# EAGLE design violed_v2_5 (EAGLE 8.2.1)
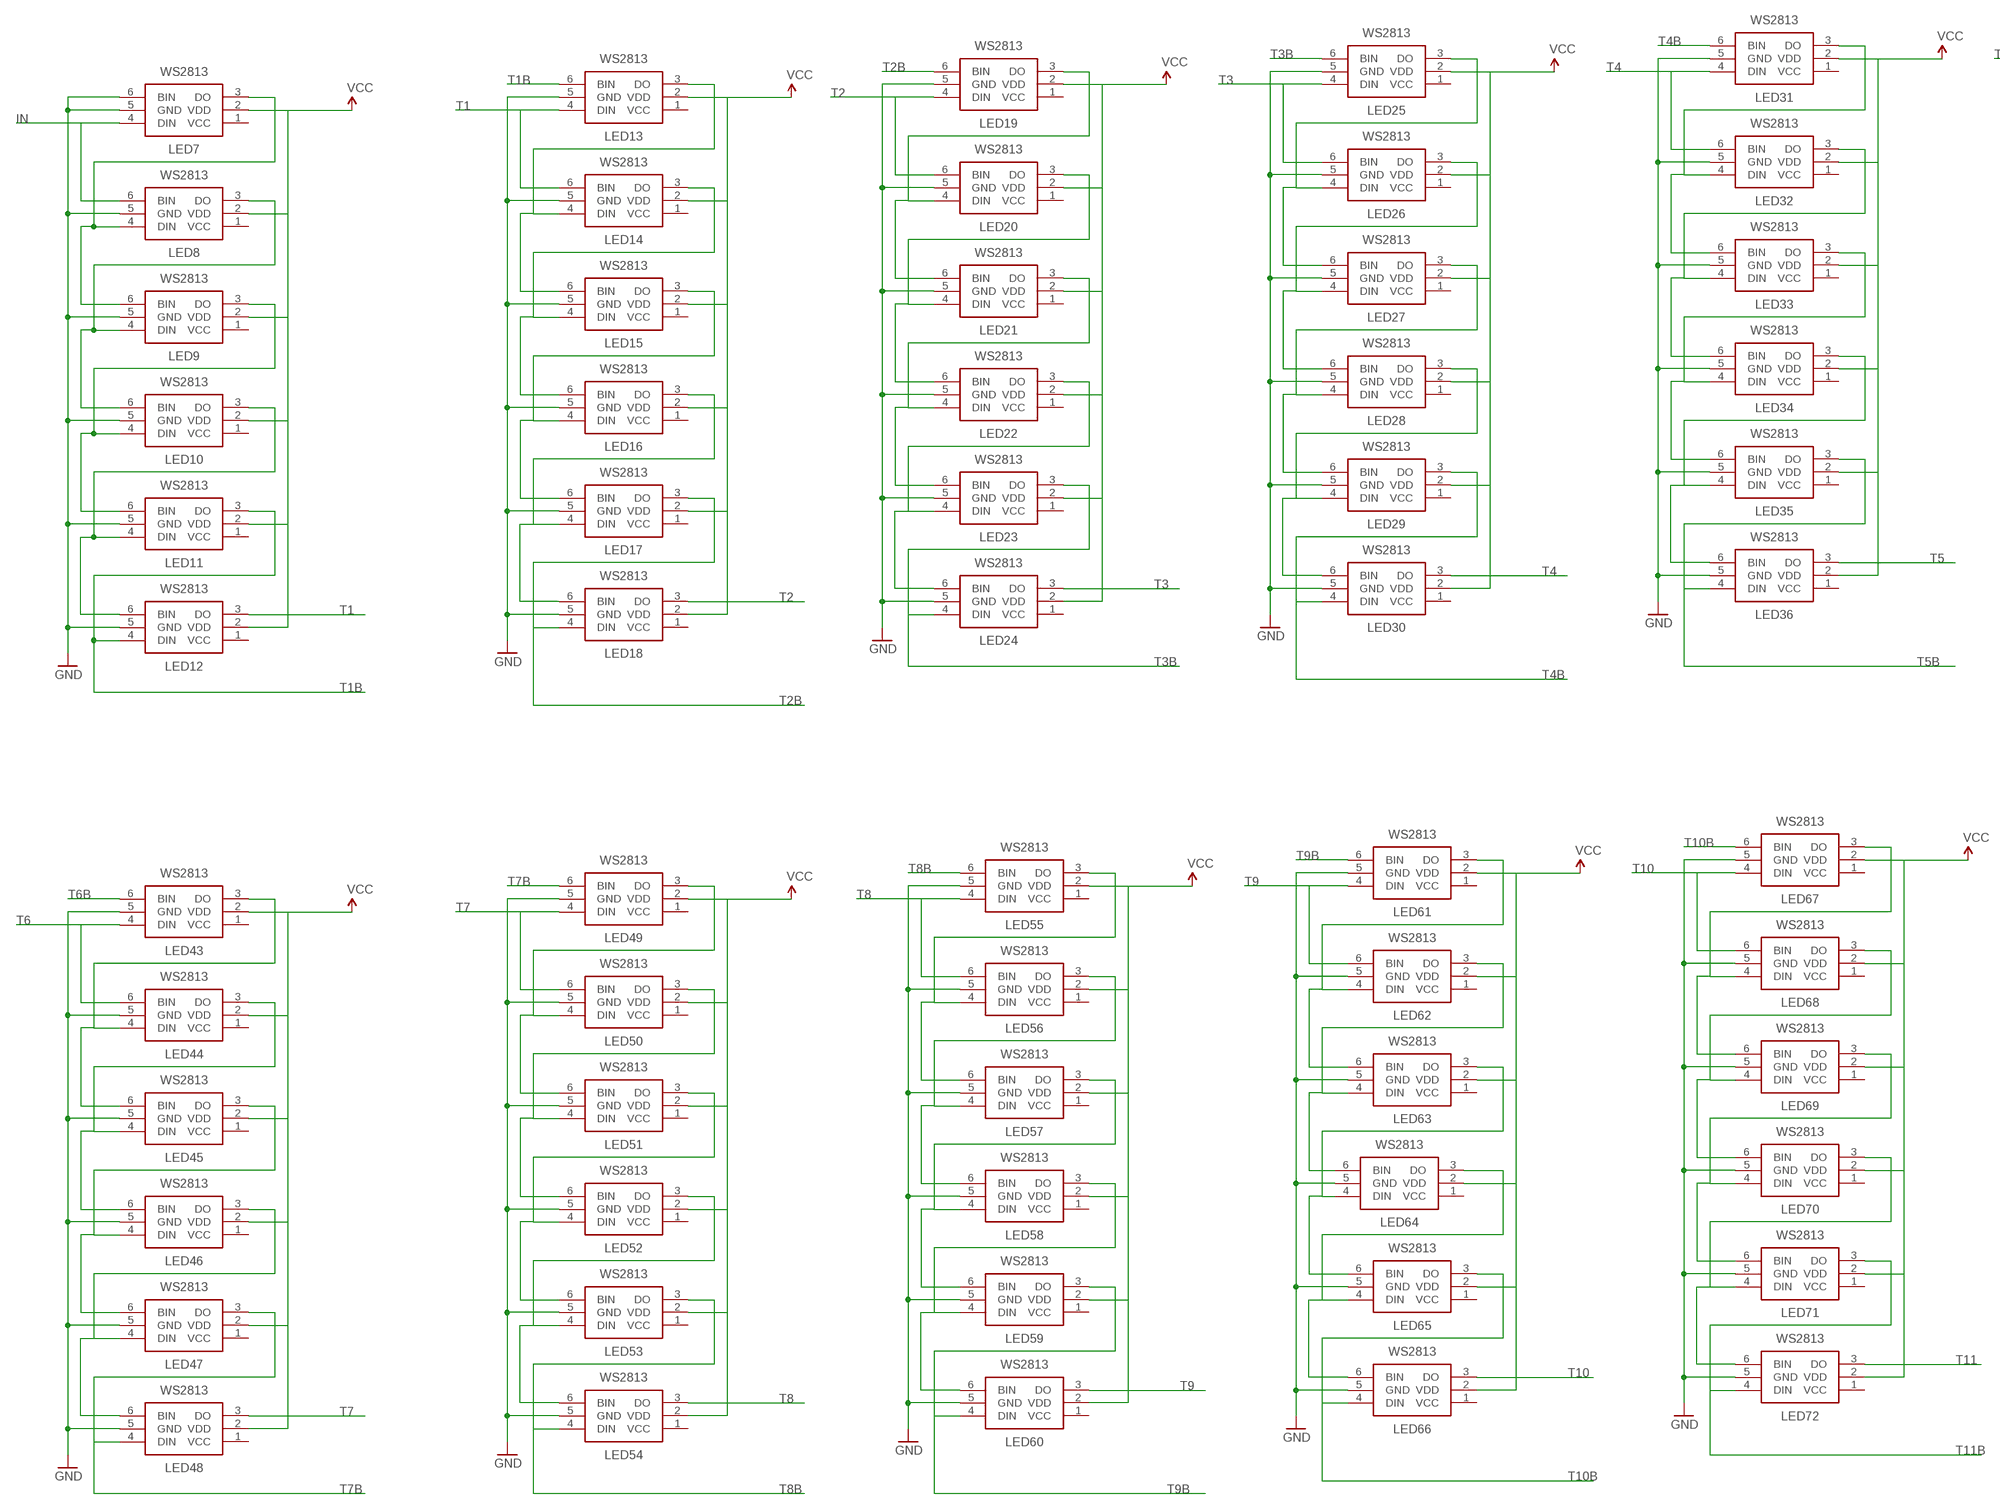
[diagram p0: schematic, sheet 1, part 1 of 2]
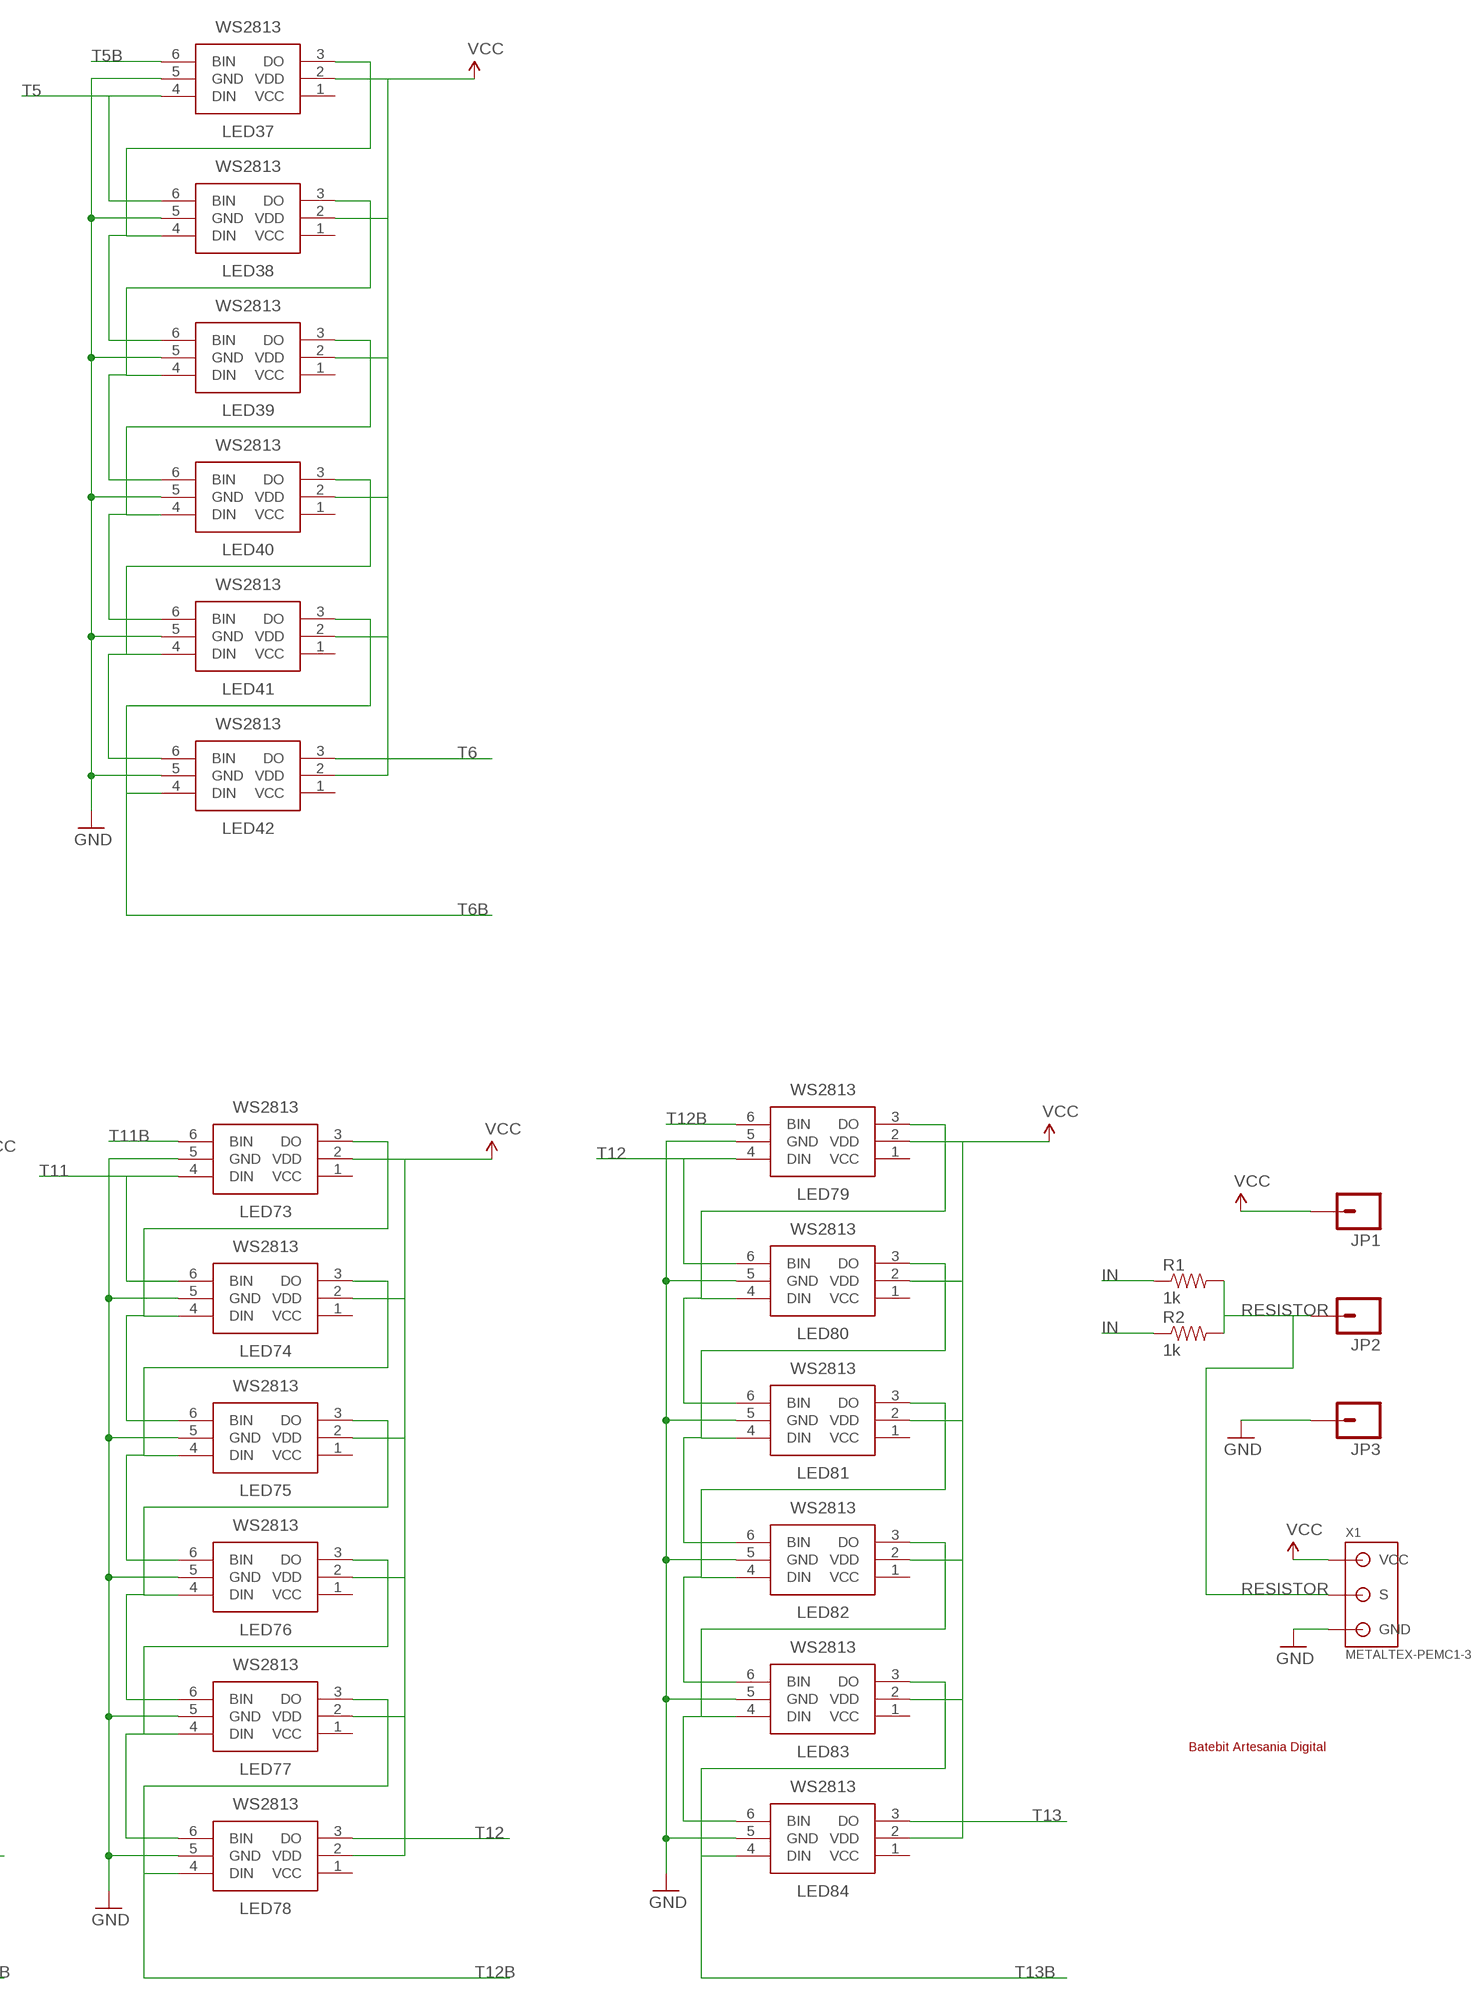
[diagram p1: schematic, sheet 1, part 2 of 2]

## Parts
JP1  M01PTH_LONGPAD  [1X01_LONGPAD]
JP2  M01PTH_LONGPAD  [1X01_LONGPAD]
JP3  M01PTH_LONGPAD  [1X01_LONGPAD]
LED7  WS2813  [WS2812]
LED8  WS2813  [WS2812]
LED9  WS2813  [WS2812]
LED10  WS2813  [WS2812]
LED11  WS2813  [WS2812]
LED12  WS2813  [WS2812]
LED13  WS2813  [WS2812]
LED14  WS2813  [WS2812]
LED15  WS2813  [WS2812]
LED16  WS2813  [WS2812]
LED17  WS2813  [WS2812]
LED18  WS2813  [WS2812]
LED19  WS2813  [WS2812]
LED20  WS2813  [WS2812]
LED21  WS2813  [WS2812]
LED22  WS2813  [WS2812]
LED23  WS2813  [WS2812]
LED24  WS2813  [WS2812]
LED25  WS2813  [WS2812]
LED26  WS2813  [WS2812]
LED27  WS2813  [WS2812]
LED28  WS2813  [WS2812]
LED29  WS2813  [WS2812]
LED30  WS2813  [WS2812]
LED31  WS2813  [WS2812]
LED32  WS2813  [WS2812]
LED33  WS2813  [WS2812]
LED34  WS2813  [WS2812]
LED35  WS2813  [WS2812]
LED36  WS2813  [WS2812]
LED37  WS2813  [WS2812]
LED38  WS2813  [WS2812]
LED39  WS2813  [WS2812]
LED40  WS2813  [WS2812]
LED41  WS2813  [WS2812]
LED42  WS2813  [WS2812]
LED43  WS2813  [WS2812]
LED44  WS2813  [WS2812]
LED45  WS2813  [WS2812]
LED46  WS2813  [WS2812]
LED47  WS2813  [WS2812]
LED48  WS2813  [WS2812]
LED49  WS2813  [WS2812]
LED50  WS2813  [WS2812]
LED51  WS2813  [WS2812]
LED52  WS2813  [WS2812]
LED53  WS2813  [WS2812]
LED54  WS2813  [WS2812]
LED55  WS2813  [WS2812]
LED56  WS2813  [WS2812]
LED57  WS2813  [WS2812]
LED58  WS2813  [WS2812]
LED59  WS2813  [WS2812]
LED60  WS2813  [WS2812]
LED61  WS2813  [WS2812]
LED62  WS2813  [WS2812]
LED63  WS2813  [WS2812]
LED64  WS2813  [WS2812]
LED65  WS2813  [WS2812]
LED66  WS2813  [WS2812]
LED67  WS2813  [WS2812]
LED68  WS2813  [WS2812]
LED69  WS2813  [WS2812]
LED70  WS2813  [WS2812]
LED71  WS2813  [WS2812]
LED72  WS2813  [WS2812]
LED73  WS2813  [WS2812]
LED74  WS2813  [WS2812]
LED75  WS2813  [WS2812]
LED76  WS2813  [WS2812]
LED77  WS2813  [WS2812]
LED78  WS2813  [WS2812]
LED79  WS2813  [WS2812]
LED80  WS2813  [WS2812]
LED81  WS2813  [WS2812]
LED82  WS2813  [WS2812]
LED83  WS2813  [WS2812]
LED84  WS2813  [WS2812]
R1  1k  RESISTOR0805-RES  [0805]
R2  1k  RESISTORPTH-1/4W  [AXIAL-0.4]
U$1  BATEBITTOP  [BATEBIT_MED_TOP_LAYER]
X1  METALTEX-PEMC1-3  [METALTEX-PEMC1-3-PACKAGE-LONG-PAD]

## Nets
GND: JP3.1 LED7.5(GND) LED7.6(BIN) LED8.5(GND) LED9.5(GND) LED10.5(GND) LED11.5(GND) LED12.5(GND) LED13.5(GND) LED14.5(GND) LED15.5(GND) LED16.5(GND) LED17.5(GND) LED18.5(GND) LED19.5(GND) LED20.5(GND) LED21.5(GND) LED22.5(GND) LED23.5(GND) LED24.5(GND) LED25.5(GND) LED26.5(GND) LED27.5(GND) LED28.5(GND) LED29.5(GND) LED30.5(GND) LED31.5(GND) LED32.5(GND) LED33.5(GND) LED34.5(GND) LED35.5(GND) LED36.5(GND) LED37.5(GND) LED38.5(GND) LED39.5(GND) LED40.5(GND) LED41.5(GND) LED42.5(GND) LED43.5(GND) LED44.5(GND) LED45.5(GND) LED46.5(GND) LED47.5(GND) LED48.5(GND) LED49.5(GND) LED50.5(GND) LED51.5(GND) LED52.5(GND) LED53.5(GND) LED54.5(GND) LED55.5(GND) LED56.5(GND) LED57.5(GND) LED58.5(GND) LED59.5(GND) LED60.5(GND) LED61.5(GND) LED62.5(GND) LED63.5(GND) LED64.5(GND) LED65.5(GND) LED66.5(GND) LED67.5(GND) LED68.5(GND) LED69.5(GND) LED70.5(GND) LED71.5(GND) LED72.5(GND) LED73.5(GND) LED74.5(GND) LED75.5(GND) LED76.5(GND) LED77.5(GND) LED78.5(GND) LED79.5(GND) LED80.5(GND) LED81.5(GND) LED82.5(GND) LED83.5(GND) LED84.5(GND) X1.1(GND)
IN: LED7.4(DIN) LED8.6(BIN) R1.1 R2.P$1
N$6: LED7.3(DO) LED8.4(DIN) LED9.6(BIN)
N$7: LED8.3(DO) LED9.4(DIN) LED10.6(BIN)
N$8: LED9.3(DO) LED10.4(DIN) LED11.6(BIN)
N$9: LED10.3(DO) LED11.4(DIN) LED12.6(BIN)
N$11: LED13.3(DO) LED14.4(DIN) LED15.6(BIN)
N$12: LED14.3(DO) LED15.4(DIN) LED16.6(BIN)
N$13: LED15.3(DO) LED16.4(DIN) LED17.6(BIN)
N$14: LED16.3(DO) LED17.4(DIN) LED18.6(BIN)
N$16: LED19.3(DO) LED20.4(DIN) LED21.6(BIN)
N$17: LED20.3(DO) LED21.4(DIN) LED22.6(BIN)
N$18: LED21.3(DO) LED22.4(DIN) LED23.6(BIN)
N$19: LED22.3(DO) LED23.4(DIN) LED24.6(BIN)
N$21: LED25.3(DO) LED26.4(DIN) LED27.6(BIN)
N$22: LED26.3(DO) LED27.4(DIN) LED28.6(BIN)
N$23: LED27.3(DO) LED28.4(DIN) LED29.6(BIN)
N$24: LED28.3(DO) LED29.4(DIN) LED30.6(BIN)
N$26: LED31.3(DO) LED32.4(DIN) LED33.6(BIN)
N$27: LED32.3(DO) LED33.4(DIN) LED34.6(BIN)
N$28: LED33.3(DO) LED34.4(DIN) LED35.6(BIN)
N$29: LED34.3(DO) LED35.4(DIN) LED36.6(BIN)
N$31: LED37.3(DO) LED38.4(DIN) LED39.6(BIN)
N$32: LED38.3(DO) LED39.4(DIN) LED40.6(BIN)
N$33: LED39.3(DO) LED40.4(DIN) LED41.6(BIN)
N$34: LED40.3(DO) LED41.4(DIN) LED42.6(BIN)
N$36: LED43.3(DO) LED44.4(DIN) LED45.6(BIN)
N$37: LED44.3(DO) LED45.4(DIN) LED46.6(BIN)
N$38: LED45.3(DO) LED46.4(DIN) LED47.6(BIN)
N$39: LED46.3(DO) LED47.4(DIN) LED48.6(BIN)
N$41: LED49.3(DO) LED50.4(DIN) LED51.6(BIN)
N$42: LED50.3(DO) LED51.4(DIN) LED52.6(BIN)
N$43: LED51.3(DO) LED52.4(DIN) LED53.6(BIN)
N$44: LED52.3(DO) LED53.4(DIN) LED54.6(BIN)
N$46: LED55.3(DO) LED56.4(DIN) LED57.6(BIN)
N$47: LED56.3(DO) LED57.4(DIN) LED58.6(BIN)
N$48: LED57.3(DO) LED58.4(DIN) LED59.6(BIN)
N$49: LED58.3(DO) LED59.4(DIN) LED60.6(BIN)
N$51: LED61.3(DO) LED62.4(DIN) LED63.6(BIN)
N$52: LED62.3(DO) LED63.4(DIN) LED64.6(BIN)
N$53: LED63.3(DO) LED64.4(DIN) LED65.6(BIN)
N$54: LED64.3(DO) LED65.4(DIN) LED66.6(BIN)
N$56: LED67.3(DO) LED68.4(DIN) LED69.6(BIN)
N$57: LED68.3(DO) LED69.4(DIN) LED70.6(BIN)
N$58: LED69.3(DO) LED70.4(DIN) LED71.6(BIN)
N$59: LED70.3(DO) LED71.4(DIN) LED72.6(BIN)
N$61: LED73.3(DO) LED74.4(DIN) LED75.6(BIN)
N$62: LED74.3(DO) LED75.4(DIN) LED76.6(BIN)
N$63: LED75.3(DO) LED76.4(DIN) LED77.6(BIN)
N$64: LED76.3(DO) LED77.4(DIN) LED78.6(BIN)
N$66: LED79.3(DO) LED80.4(DIN) LED81.6(BIN)
N$67: LED80.3(DO) LED81.4(DIN) LED82.6(BIN)
N$68: LED81.3(DO) LED82.4(DIN) LED83.6(BIN)
N$69: LED82.3(DO) LED83.4(DIN) LED84.6(BIN)
RESISTOR: JP2.1 R1.2 R2.P$2 X1.2(S)
T1: LED12.3(DO) LED13.4(DIN) LED14.6(BIN)
T1B: LED11.3(DO) LED12.4(DIN) LED13.6(BIN)
T2: LED18.3(DO) LED19.4(DIN) LED20.6(BIN)
T2B: LED17.3(DO) LED18.4(DIN) LED19.6(BIN)
T3: LED24.3(DO) LED25.4(DIN) LED26.6(BIN)
T3B: LED23.3(DO) LED24.4(DIN) LED25.6(BIN)
T4: LED30.3(DO) LED31.4(DIN) LED32.6(BIN)
T4B: LED29.3(DO) LED30.4(DIN) LED31.6(BIN)
T5: LED36.3(DO) LED37.4(DIN) LED38.6(BIN)
T5B: LED35.3(DO) LED36.4(DIN) LED37.6(BIN)
T6: LED42.3(DO) LED43.4(DIN) LED44.6(BIN)
T6B: LED41.3(DO) LED42.4(DIN) LED43.6(BIN)
T7: LED48.3(DO) LED49.4(DIN) LED50.6(BIN)
T7B: LED47.3(DO) LED48.4(DIN) LED49.6(BIN)
T8: LED54.3(DO) LED55.4(DIN) LED56.6(BIN)
T8B: LED53.3(DO) LED54.4(DIN) LED55.6(BIN)
T9: LED60.3(DO) LED61.4(DIN) LED62.6(BIN)
T9B: LED59.3(DO) LED60.4(DIN) LED61.6(BIN)
T10: LED66.3(DO) LED67.4(DIN) LED68.6(BIN)
T10B: LED65.3(DO) LED66.4(DIN) LED67.6(BIN)
T11: LED72.3(DO) LED73.4(DIN) LED74.6(BIN)
T11B: LED71.3(DO) LED72.4(DIN) LED73.6(BIN)
T12: LED78.3(DO) LED79.4(DIN) LED80.6(BIN)
T12B: LED77.3(DO) LED78.4(DIN) LED79.6(BIN)
T13: LED84.3(DO)
T13B: LED83.3(DO) LED84.4(DIN)
VCC: JP1.1 LED7.2(VDD) LED8.2(VDD) LED9.2(VDD) LED10.2(VDD) LED11.2(VDD) LED12.2(VDD) LED13.2(VDD) LED14.2(VDD) LED15.2(VDD) LED16.2(VDD) LED17.2(VDD) LED18.2(VDD) LED19.2(VDD) LED20.2(VDD) LED21.2(VDD) LED22.2(VDD) LED23.2(VDD) LED24.2(VDD) LED25.2(VDD) LED26.2(VDD) LED27.2(VDD) LED28.2(VDD) LED29.2(VDD) LED30.2(VDD) LED31.2(VDD) LED32.2(VDD) LED33.2(VDD) LED34.2(VDD) LED35.2(VDD) LED36.2(VDD) LED37.2(VDD) LED38.2(VDD) LED39.2(VDD) LED40.2(VDD) LED41.2(VDD) LED42.2(VDD) LED43.2(VDD) LED44.2(VDD) LED45.2(VDD) LED46.2(VDD) LED47.2(VDD) LED48.2(VDD) LED49.2(VDD) LED50.2(VDD) LED51.2(VDD) LED52.2(VDD) LED53.2(VDD) LED54.2(VDD) LED55.2(VDD) LED56.2(VDD) LED57.2(VDD) LED58.2(VDD) LED59.2(VDD) LED60.2(VDD) LED61.2(VDD) LED62.2(VDD) LED63.2(VDD) LED64.2(VDD) LED65.2(VDD) LED66.2(VDD) LED67.2(VDD) LED68.2(VDD) LED69.2(VDD) LED70.2(VDD) LED71.2(VDD) LED72.2(VDD) LED73.2(VDD) LED74.2(VDD) LED75.2(VDD) LED76.2(VDD) LED77.2(VDD) LED78.2(VDD) LED79.2(VDD) LED80.2(VDD) LED81.2(VDD) LED82.2(VDD) LED83.2(VDD) LED84.2(VDD) X1.3(VCC)
Unconnected: LED7.1(VCC) LED8.1(VCC) LED9.1(VCC) LED10.1(VCC) LED11.1(VCC) LED12.1(VCC) LED13.1(VCC) LED14.1(VCC) LED15.1(VCC) LED16.1(VCC) LED17.1(VCC) LED18.1(VCC) LED19.1(VCC) LED20.1(VCC) LED21.1(VCC) LED22.1(VCC) LED23.1(VCC) LED24.1(VCC) LED25.1(VCC) LED26.1(VCC) LED27.1(VCC) LED28.1(VCC) LED29.1(VCC) LED30.1(VCC) LED31.1(VCC) LED32.1(VCC) LED33.1(VCC) LED34.1(VCC) LED35.1(VCC) LED36.1(VCC) LED37.1(VCC) LED38.1(VCC) LED39.1(VCC) LED40.1(VCC) LED41.1(VCC) LED42.1(VCC) LED43.1(VCC) LED44.1(VCC) LED45.1(VCC) LED46.1(VCC) LED47.1(VCC) LED48.1(VCC) LED49.1(VCC) LED50.1(VCC) LED51.1(VCC) LED52.1(VCC) LED53.1(VCC) LED54.1(VCC) LED55.1(VCC) LED56.1(VCC) LED57.1(VCC) LED58.1(VCC) LED59.1(VCC) LED60.1(VCC) LED61.1(VCC) LED62.1(VCC) LED63.1(VCC) LED64.1(VCC) LED65.1(VCC) LED66.1(VCC) LED67.1(VCC) LED68.1(VCC) LED69.1(VCC) LED70.1(VCC) LED71.1(VCC) LED72.1(VCC) LED73.1(VCC) LED74.1(VCC) LED75.1(VCC) LED76.1(VCC) LED77.1(VCC) LED78.1(VCC) LED79.1(VCC) LED80.1(VCC) LED81.1(VCC) LED82.1(VCC) LED83.1(VCC) LED84.1(VCC)

## Library data of the parts
JP1-JP3 = Batebit:M01: Header 1 Standard 1-pin 0.1" header. Use with straight break away headers (SKU : PRT-00116), right angle break away headers (PRT-00553), swiss pins (PRT-00743), machine pins (PRT-00117), and female headers (PRT-00115).
LED7-LED84 = Batebit:WS2813: Intelligent control integrated LED light source Source: Datasheet <http://www.tme.eu/gb/Document/cf443473af21167b0bdd177fb1a7e90a/WS2813.pdf>; DESCRIPTION: Intelligent control integrated LED light source; HEIGHT: mm; MANUFACTURER_NAME: Worldsemi; MANUFACTURER_PART_NUMBER: WS2813; SUPPLIER_NAME: RS
R1 R2 = Batebit:RESISTOR: Resistor Basic schematic elements and footprints for 0603, 1206, and PTH resistors.
U$1 = Batebit:BATEBIT
X1 = Batebit:METALTEX-PEMC1-3: Metaltex PEMC1-2 (2.54 mm) 3 pin Wire to board connector. Pitch: 2,54 mm, (0.100") Number of pins: 3 Created by Batebit

## Net classes
0 default: width 0.61 mm, drill 1 mm, clearance 0.61 mm

## Board
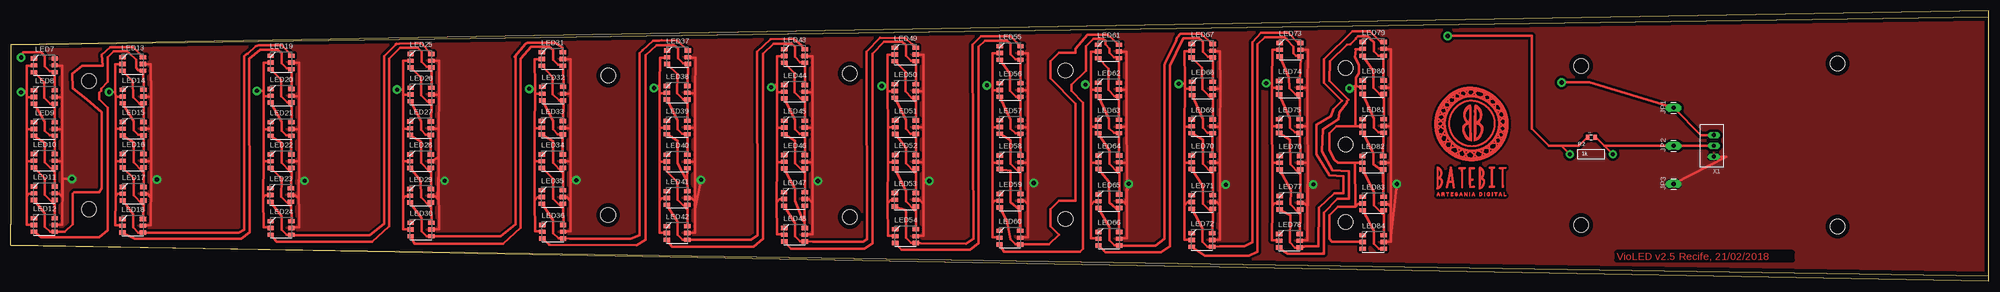
[diagram p2: board, top side]
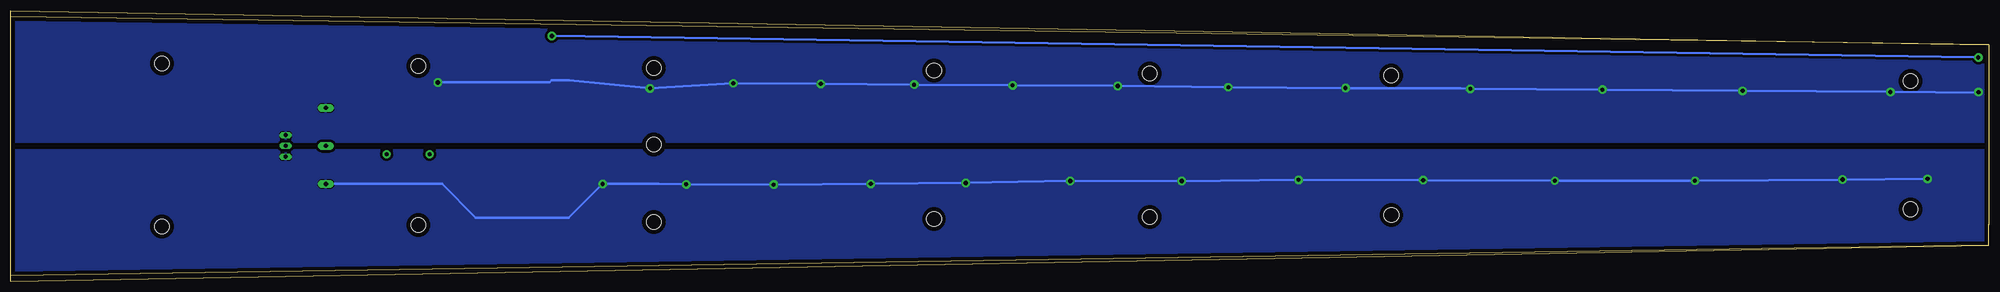
[diagram p3: board, bottom side, seen from below]

Size 468.09 x 64 mm. Coordinates in mm from the lower left corner, seen from the top.
Outline: 0.01,13.41 0.01,8.46 468,0 468,64 0.01,55.86
Outline: 0.01,55.86 0.01,35.91
Outline: 0.01,35.89 0.01,13.41
Outline: 0.01,13.41 0.01,13.39
Outline: 0.01,55.86 468.09,62.59
Outline: 0,8.46 468.01,1.32
Copper layers (1*16): Top 0.035mm / dielectric 1.5mm / Bottom 0.035mm
Design rules "default": minimum track width 6mil, minimum drill 0.35mm, track to track 6mil, track to pad 6mil, pad to pad 6mil, via to via 6mil, smd to smd 6mil, copper to edge 40mil, drill to drill 6mil, minimum pad ring 10mil, minimum via ring 8mil, stop-mask expansion 4mil, vias tented up to drill 0mil, thermal gap 10mil
Holes 3.5 mm at 18.56,47.35 18.56,17 141.42,48.6 141.37,15.65 198.61,49.15 198.61,15.15 249.6,49.8 249.6,14.7 315.85,50.4 315.85,14 371.56,50.85 371.56,13.25 432.31,51.45 432.31,12.9 315.85,32.3

### Footprints (pad centres in the part's own frame; a part is rotated, then mirrored left to right if it is on the bottom)
1X01_LONGPAD = drill 1 pad 1.88 long: 1 0,0
WS2812 = smd 1.5 x 1: 1 2.45,-1.6; 2 2.45,0; 3 2.45,1.6; 4 -2.45,1.6; 5 -2.45,0; 6 -2.45,-1.6
0805 = smd 0.8 x 1.2: 1 -0.9,0; 2 0.9,0
AXIAL-0.4 = drill 1 pad 1.88: P$1 -5.08,0; P$2 5.08,0
METALTEX-PEMC1-3-PACKAGE-LONG-PAD = drill 1.016 long: 1 -2.54,-0.5; 2 0,-0.5; 3 2.54,-0.5

### Placement (x,y rotation side)
JP1  393.5,41 90 top
JP2  393.5,32 90 top
JP3  393.5,23 90 top
LED7  8,51.04 180 top
LED8  8,43.55 180 top
LED9  8,35.96 180 top
LED10  8,28.47 180 top
LED11  8,20.78 180 top
LED12  8,13.29 180 top
LED13  28.9,51.34 180 top
LED14  29,43.65 180 top
LED15  29,36.06 180 top
LED16  29,28.47 180 top
LED17  29,20.68 180 top
LED18  28.9,13.09 180 top
LED19  64,51.74 180 top
LED20  64,43.85 180 top
LED21  64,35.96 180 top
LED22  64,28.37 180 top
LED23  63.9,20.38 180 top
LED24  64,12.59 180 top
LED25  97.1,52.14 180 top
LED26  97.1,44.15 180 top
LED27  97,36.16 180 top
LED28  97,28.37 180 top
LED29  97,20.18 180 top
LED30  97.1,12.19 180 top
LED31  128.2,52.54 180 top
LED32  128.3,44.35 180 top
LED33  128.2,36.26 180 top
LED34  128.2,28.37 180 top
LED35  128.2,19.88 180 top
LED36  128.3,11.69 180 top
LED37  157.8,52.94 180 top
LED38  157.7,44.55 180 top
LED39  157.7,36.36 180 top
LED40  157.7,28.27 180 top
LED41  157.7,19.68 180 top
LED42  157.7,11.39 180 top
LED43  185.5,53.24 180 top
LED44  185.5,44.8 180 top
LED45  185.5,36.36 180 top
LED46  185.5,28.22 180 top
LED47  185.45,19.43 180 top
LED48  185.5,10.99 180 top
LED49  211.7,53.59 180 top
LED50  211.7,45 180 top
LED51  211.75,36.41 180 top
LED52  211.75,28.22 180 top
LED53  211.7,19.23 180 top
LED54  211.75,10.64 180 top
LED55  236.5,53.94 180 top
LED56  236.5,45.2 180 top
LED57  236.5,36.46 180 top
LED58  236.5,28.12 180 top
LED59  236.5,19.03 180 top
LED60  236.45,10.29 180 top
LED61  259.8,54.34 180 top
LED62  259.8,45.35 180 top
LED63  259.8,36.56 180 top
LED64  259.85,28.12 180 top
LED65  259.85,18.88 180 top
LED66  259.85,10.04 180 top
LED67  281.95,54.49 180 top
LED68  282,45.55 180 top
LED69  281.95,36.61 180 top
LED70  281.95,28.12 180 top
LED71  281.95,18.73 180 top
LED72  281.9,9.74 180 top
LED73  302.75,54.74 180 top
LED74  302.6,45.75 180 top
LED75  302.6,36.66 180 top
LED76  302.7,28.02 180 top
LED77  302.7,18.53 180 top
LED78  302.6,9.54 180 top
LED79  322.4,54.94 180 top
LED80  322.4,45.85 180 top
LED81  322.4,36.71 180 top
LED82  322.3,28.02 180 top
LED83  322.4,18.38 180 top
LED84  322.4,9.24 180 top
R1  374,34 0 top
R2  374,30 0 top
U$1  346,33 0 top
X1  402.5,32 90 top

### Tracks (layer width: path | path; a pad name or v marks a point on that pad's centre or on a via)
GND  (via drill 1 pad 2)
  Top 0.61: LED7.6 10.51,52.56 10.51,51.14 LED7.5 10.67,50.98 12.25,50.98 12.25,43.49 | 12.29,24.21 12.25,19.92 12.09,20.08 | 12.29,24.21 12.25,13.39 10.51,13.39 LED12.5 | 12.09,20.08 11.46,20.72 10.51,20.72 LED11.5 | 12.25,28.41 10.51,28.41 LED10.5 | 12.25,28.41 12.25,20.24 12.09,20.08 | 12.25,35.9 10.51,35.9 LED9.5 | 12.25,28.41 12.25,35.9 | 12.25,43.49 10.51,43.49 LED8.5 | 12.25,35.9 12.25,43.49 | 33.29,24.1 33.25,19.82 33.09,19.98 | 33.29,24.1 33.15,13.19 31.41,13.19 LED18.5 | 33.09,19.98 32.46,20.62 31.51,20.62 LED17.5 | 33.25,28.41 31.51,28.41 LED16.5 | 33.25,28.41 33.25,20.14 33.09,19.98 | 33.25,36 31.51,36 LED15.5 | 33.25,28.41 33.25,36 | 33.25,43.59 31.51,43.59 LED14.5 | 33.25,36 33.25,43.59 | 33.25,43.59 33.15,51.28 31.56,51.28 LED13.5 | 68.19,23.8 68.15,19.52 67.99,19.68 | 68.19,23.8 68.25,12.69 66.51,12.69 LED24.5 | 67.99,19.68 67.36,20.32 66.41,20.32 LED23.5 | 68.25,28.31 66.51,28.31 LED22.5 | 68.25,28.31 68.15,19.84 67.99,19.68 | 68.25,35.9 66.51,35.9 LED21.5 | 68.25,28.31 68.25,35.9 | 68.25,43.79 66.51,43.79 LED20.5 | 68.25,35.9 68.25,43.79 | 68.25,43.79 68.25,51.68 66.66,51.68 LED19.5 | 101.25,26.32 101.33,23.8 | 101.33,23.8 101.35,12.29 99.61,12.29 LED30.5 | 101.09,19.48 100.46,20.12 99.51,20.12 LED29.5 | 101.09,19.48 101.25,26.32 | 101.25,29.31 99.51,28.31 LED28.5 | 101.25,26.32 101.25,20.64 101.09,19.48 | 101.25,26.32 101.25,29.31 | 101.25,36.1 99.51,36.1 LED27.5 | 101.25,29.31 101.25,36.1 | 101.35,44.09 99.61,44.09 LED26.5 | 101.25,36.1 101.35,44.09 | 101.35,44.09 101.35,52.08 99.77,52.08 LED25.5 | 132.48,23.9 132.45,19.02 132.29,19.18 | 132.48,23.9 132.55,11.79 130.81,11.79 LED36.5 | 132.29,19.18 131.66,19.82 130.71,19.82 LED35.5
  Top 0.61: 132.45,28.31 130.71,28.31 LED34.5 | 132.45,28.31 132.45,19.34 132.29,19.18 | 132.45,36.2 130.71,36.2 LED33.5 | 132.45,28.31 132.45,36.2 | 132.55,44.29 130.81,44.29 LED32.5 | 132.45,36.2 132.55,44.29 | 132.55,44.29 132.45,52.48 130.87,52.48 LED31.5 | 161.98,16.95 161.95,18.82 161.79,18.98 | 161.98,16.95 161.95,11.49 160.21,11.49 LED42.5 | 161.79,18.98 161.16,19.62 160.21,19.62 LED41.5 | 161.95,28.21 160.21,28.21 LED40.5 | 161.95,28.21 161.95,19.14 161.79,18.98 | 161.95,36.3 160.21,36.3 LED39.5 | 161.95,28.21 161.95,36.3 | 161.95,44.49 160.21,44.49 LED38.5 | 161.95,36.3 161.95,44.49 | 161.95,44.49 162.05,52.88 160.47,52.88 LED37.5 | 189.71,23.7 189.7,18.57 189.54,18.73 | 189.71,23.7 189.75,11.09 188.01,11.09 LED48.5 | 189.54,18.73 188.91,19.37 187.96,19.37 LED47.5 | 189.75,28.16 188.01,28.16 LED46.5 | 189.75,28.16 189.7,18.89 189.54,18.73 | 189.75,36.3 188.01,36.3 LED45.5 | 189.75,28.16 189.75,36.3 | 189.75,44.74 188.01,44.74 LED44.5 | 189.75,36.3 189.75,44.74 | 189.75,44.74 189.75,53.18 188.16,53.18 LED43.5 | 215.96,23.7 215.95,18.37 215.79,18.53 | 215.96,23.7 216,10.74 214.26,10.74 LED54.5 | 215.79,18.53 215.16,19.17 214.21,19.17 LED53.5 | 216,28.16 214.26,28.16 LED52.5 | 216,28.16 215.95,18.69 215.79,18.53 | 216,36.35 214.26,36.35 LED51.5 | 216,28.16 216,36.35 | 215.95,44.94 214.21,44.94 LED50.5 | 216,36.35 215.95,44.94 | 215.95,44.94 215.95,53.53 215.89,53.59 LED49.5 | 240.76,23.15 240.75,18.17 240.59,18.33 | 240.76,23.15 240.7,10.39 238.96,10.39 LED60.5 | 240.59,18.33 239.96,18.97 239.01,18.97 LED59.5 | 240.75,28.06 239.01,28.06 LED58.5 | 240.75,28.06 240.75,18.49 240.59,18.33 | 240.75,36.4 239.01,36.4 LED57.5
  Top 0.61: 240.75,28.06 240.75,36.4 | 240.75,45.14 239.01,45.14 LED56.5 | 240.75,36.4 240.75,45.14 | 240.75,45.14 240.75,53.88 239.16,53.88 LED55.5 | 264.1,23.02 264.11,21.05 | 264.11,21.05 264.1,10.14 262.36,10.14 LED66.5 | 263.94,18.18 263.31,18.82 262.36,18.82 LED65.5 | 263.94,18.18 264.1,23.02 | 264.1,28.06 262.36,28.06 LED64.5 | 264.1,23.02 264.1,18.34 263.94,18.18 | 264.1,23.02 264.1,28.06 | 264.05,36.5 262.31,36.5 LED63.5 | 264.1,28.06 264.05,36.5 | 264.05,45.29 262.31,45.29 LED62.5 | 264.05,36.5 264.05,45.29 | 264.05,45.29 264.05,54.28 262.46,54.28 LED61.5 | 286.18,22.85 286.2,17.87 286.04,18.03 | 286.18,22.85 286.15,9.84 284.41,9.84 LED72.5 | 286.04,18.03 285.41,18.67 284.46,18.67 LED71.5 | 286.2,28.06 284.46,28.06 LED70.5 | 286.2,28.06 286.2,18.19 286.04,18.03 | 286.2,36.55 284.46,36.55 LED69.5 | 286.2,28.06 286.2,36.55 | 286.25,45.49 284.51,45.49 LED68.5 | 286.2,36.55 286.25,45.49 | 286.25,45.49 286.2,54.43 284.62,54.43 LED67.5 | 306.8,22.82 306.85,9.64 305.11,9.64 LED78.5 | 306.79,17.83 306.16,18.47 305.21,18.47 LED77.5 | 306.79,17.83 306.8,22.82 | 306.95,27.96 305.21,27.96 LED76.5 | 306.95,27.96 306.95,17.99 306.79,17.83 | 306.85,36.6 305.11,36.6 LED75.5 | 306.95,27.96 306.85,36.6 | 306.85,45.69 305.11,45.69 LED74.5 | 306.85,36.6 306.85,45.69 | 306.85,45.69 307,54.68 305.42,54.68 LED73.5 | 326.49,17.68 326.14,18.04 325.98,18.2 325.03,18.2 LED83.5 | 326.49,17.68 326.65,17.52 326.65,9.34 324.91,9.34 LED84.5 | 326.55,27.96 324.81,27.96 LED82.5 | 326.65,17.84 326.55,10.65 v328,23 | 326.65,17.84 326.55,27.96 | 326.65,17.84 326.49,17.68 | 326.65,36.65 324.91,36.65 LED81.5 | 326.55,27.96 326.65,36.65 | 326.65,45.79 324.91,45.79 LED80.5
  Top 0.61: 326.65,36.65 326.65,45.79 | 326.65,45.79 326.65,54.88 325.06,54.88 LED79.5 | v14.51,24.2 12.29,24.21 | 33.29,24.1 v34.65,24.04 | 68.19,23.8 v69.56,23.75 | 101.33,23.8 v102.71,23.75 | 132.48,23.9 v133.85,23.89 | 161.98,16.95 v163.35,23.96 | 189.71,23.7 v191.01,23.66 | 215.96,23.7 v217.36,23.7 | 240.76,23.15 v242.1,23.22 | 264.11,21.05 v264.56,23.03 | 286.18,22.85 v287.56,22.83 | 306.8,22.82 v308.25,22.9 | JP3.1 405.96,29.46 X1.1
  Bottom 0.61: v14.51,24.2 v34.65,24.04 v69.56,23.75 v102.71,23.75 v133.85,23.89 v163.35,23.96 v191.01,23.66 v217.36,23.7 v242.1,23.22 v264.56,23.03 v287.56,22.83 v308.25,22.9 314.79,23 v328,23 336,15 358,15 366,23 JP3.1
  pour Top: 0.01,8.44 468,1.39 468.18,62.53 1,56 0.01,56
  pour Bottom: 0.01,8.41 468.18,1.29 468,31 0.01,31
IN  (via drill 1 pad 2)
  Top 0.61: LED8.6 10.51,45.23 10.51,49.39 LED7.4 10.26,49.63 9.32,49.63 8.12,50.82 8.12,53.2 7.24,54.09 3.04,54.09 v2.5,52.9 | v340,58 360,58 360,36 364,32 366.93,32 | 366.93,32 R2.P$1 | 366.93,32 371.11,32 R1.1
  Bottom 0.61: v340,58 3.5,52.9 v2.5,52.9
N$6
  Top 0.61: 10.51,41.11 10.51,41.9 LED8.4 | 10.51,41.11 10.51,37.64 LED9.6 | 10.51,41.11 10.35,41.11 9.47,41.98 9.44,41.98 8,43.42 8,46.99 LED7.3
N$7
  Top 0.61: LED8.3 5.58,41.9 8.12,37.66 8.12,35.58 9.24,34.47 10.35,34.47 LED9.4 LED10.6
N$8
  Top 0.61: 10.51,26.03 10.51,26.82 LED10.4 | LED11.6 10.51,22.46 10.51,26.03 | LED9.3 5.58,34.31 8.12,32.77 8.12,28.09 10.19,26.03 10.51,26.03
N$9
  Top 0.61: 10.51,18.34 10.51,19.13 LED11.4 | 10.51,18.34 10.51,14.97 LED12.6 | LED10.3 8.12,24.29 8.12,20.4 10.19,18.34 10.51,18.34
N$11
  Top 0.61: 31.51,41.21 31.51,42 LED14.4 | 31.51,41.21 31.51,37.74 LED15.6 | 31.51,41.21 31.35,41.21 30.47,42.08 30.44,42.08 29,43.52 28.9,47.29 LED13.3
N$12
  Top 0.61: LED14.3 26.58,42 29.12,37.76 29.12,35.68 30.24,34.57 31.35,34.57 LED15.4 LED16.6
N$13
  Top 0.61: 31.51,26.03 31.51,26.82 LED16.4 | LED17.6 31.51,22.36 31.51,26.03 | LED15.3 26.58,34.41 29.12,32.87 29.12,28.09 31.19,26.03 31.51,26.03
N$14
  Top 0.61: 31.51,18.24 31.51,19.03 LED17.4 | 31.51,18.24 31.41,14.77 LED18.6 | LED16.3 29.12,24.39 29.12,20.3 31.19,18.24 31.51,18.24
N$16
  Top 0.61: 66.51,41.41 66.51,42.2 LED20.4 | 66.51,41.41 66.51,37.64 LED21.6 | 66.51,41.41 66.35,41.41 65.47,42.28 65.44,42.28 64,43.72 64,47.69 LED19.3
N$17
  Top 0.61: LED20.3 61.59,42.2 64.12,37.66 64.12,35.58 65.24,34.47 66.35,34.47 LED21.4 LED22.6
N$18
  Top 0.61: 66.51,25.93 66.51,26.72 LED22.4 | LED23.6 66.41,22.06 66.51,25.93 | LED21.3 61.59,34.31 64.12,32.77 64.12,27.99 66.19,25.93 66.51,25.93
N$19
  Top 0.61: 66.41,17.94 66.41,18.73 LED23.4 | 66.41,17.94 66.51,14.27 LED24.6 | LED22.3 64.12,24.19 64.02,20 66.09,17.94 66.41,17.94
N$21
  Top 0.61: 99.61,41.71 99.61,42.5 LED26.4 | 99.61,41.71 99.51,37.84 LED27.6 | 99.61,41.71 99.45,41.71 98.57,42.58 98.54,42.58 97.1,44.02 97.1,48.09 LED25.3
N$22
  Top 0.61: LED26.3 94.69,42.5 97.12,37.86 97.12,35.78 98.24,34.67 99.35,34.67 LED27.4 LED28.6
N$23
  Top 0.61: 99.51,25.93 99.51,26.72 LED28.4 | LED29.6 99.51,21.86 99.51,25.93 | LED27.3 94.58,34.51 97.12,32.97 97.12,27.99 99.19,25.93 99.51,25.93
N$24
  Top 0.61: 99.51,17.74 99.51,18.53 LED29.4 | 99.51,17.74 99.61,13.87 LED30.6 | LED28.3 97.02,23.79 97.12,19.8 99.19,17.74 99.51,17.74
N$26
  Top 0.61: 130.81,41.91 130.81,42.7 LED32.4 | 130.81,41.91 130.71,37.94 LED33.6 | 130.81,41.91 130.65,41.91 129.77,42.78 129.74,42.78 128.3,44.22 128.3,48.19 LED31.3
N$27
  Top 0.61: LED32.3 125.88,42.7 128.32,37.96 128.32,35.88 129.44,34.77 130.55,34.77 LED33.4 LED34.6
N$28
  Top 0.61: 130.71,25.93 130.71,26.72 LED34.4 | LED35.6 130.71,21.56 130.71,25.93 | LED33.3 125.78,34.61 128.32,33.07 128.32,27.99 130.39,25.93 130.71,25.93
N$29
  Top 0.61: 130.71,17.44 130.71,18.23 LED35.4 | 130.71,17.44 130.81,13.37 LED36.6 | LED34.3 128.32,24.19 128.32,19.5 130.39,17.44 130.71,17.44
N$31
  Top 0.61: 160.21,42.11 160.21,42.9 LED38.4 | 160.21,42.11 160.21,38.04 LED39.6 | 160.21,42.11 160.05,42.11 159.17,42.98 159.14,42.98 157.7,44.42 157.8,48.89 LED37.3
N$32
  Top 0.61: LED38.3 155.28,42.9 157.82,38.06 157.82,35.98 158.94,34.87 160.05,34.87 LED39.4 LED40.6
N$33
  Top 0.61: 160.11,24.13 160.21,26.62 LED40.4 | LED41.6 160.21,21.36 160.11,24.13 | LED39.3 155.28,34.71 157.82,33.17 157.82,27.89 159.79,24.13 160.11,24.13
N$34
  Top 0.61: 160.21,17.24 160.21,18.03 LED41.4 | 160.21,17.24 160.21,13.07 LED42.6 | 160.21,17.24 159.89,17.24 157.82,19.3 157.82,23.39 155.25,25.97 LED40.3
N$36
  Top 0.61: 188.01,42.36 188.01,43.15 LED44.4 | 188.01,42.36 188.01,38.04 LED45.6 | 188.01,42.36 187.85,42.36 186.97,43.23 186.94,43.23 185.5,44.67 185.5,49.19 LED43.3
N$37
  Top 0.61: LED44.3 183.09,43.15 185.62,38.06 185.62,35.98 186.74,34.87 187.85,34.87 LED45.4 LED46.6
N$38
  Top 0.61: 188.01,25.78 188.01,26.57 LED46.4 | LED47.6 187.96,21.11 188.01,25.78 | LED45.3 183.09,34.71 185.62,33.17 185.62,27.84 187.69,25.78 188.01,25.78
N$39
  Top 0.61: 187.86,14.29 187.86,15.08 LED47.4 | 187.86,14.29 188.01,12.67 LED48.6 | LED46.3 185.57,21.79 185.57,19.05 187.54,14.29 187.86,14.29
N$41
  Top 0.61: 214.21,42.56 214.21,43.35 LED50.4 | 214.21,42.56 214.26,38.09 LED51.6 | 214.21,42.56 214.05,42.56 213.17,43.43 213.14,43.43 211.7,44.87 211.7,49.54 LED49.3
N$42
  Top 0.61: LED50.3 209.28,43.35 211.88,38.11 211.88,36.03 212.99,34.92 214.1,34.92 LED51.4 LED52.6
N$43
  Top 0.61: 214.26,25.78 214.26,26.57 LED52.4 | LED53.6 214.21,20.91 214.26,25.78 | LED51.3 209.34,34.76 211.92,31.52 211.88,27.84 213.94,25.78 214.26,25.78
N$44
  Top 0.61: 214.21,16.79 214.21,17.58 LED53.4 | 214.21,16.79 214.26,12.32 LED54.6 | LED52.3 211.88,21.24 211.82,18.85 213.89,16.79 214.21,16.79
N$46
  Top 0.61: 239.01,42.76 239.01,43.55 LED56.4 | 239.01,42.76 239.01,38.14 LED57.6 | 239.01,42.76 238.85,42.76 237.97,43.63 237.94,43.63 236.5,45.07 236.5,49.04 LED55.3
N$47
  Top 0.61: LED56.3 234.09,43.55 236.62,38.16 236.62,36.08 237.74,34.97 238.85,34.97 LED57.4 LED58.6
N$48
  Top 0.61: 239.01,25.68 239.01,26.47 LED58.4 | LED59.6 239.01,20.71 239.01,25.68 | LED57.3 234.09,34.81 236.62,33.27 236.62,27.74 238.69,25.68 239.01,25.68
N$49
  Top 0.61: 238.91,11.64 239.01,17.38 LED59.4 | 238.91,11.64 238.96,11.97 LED60.6 | LED58.3 236.62,26.09 236.62,18.65 238.59,17.04 238.91,11.64
N$51
  Top 0.61: 262.31,42.91 262.31,43.7 LED62.4 | 262.31,42.91 262.31,38.24 LED63.6 | 262.31,42.91 262.15,42.91 261.27,43.78 261.24,43.78 259.8,45.22 259.8,50.29 LED61.3
N$52
  Top 0.61: LED62.3 257.38,43.7 259.93,38.26 259.93,36.18 261.04,35.07 262.15,35.07 LED63.4 LED64.6
N$53
  Top 0.61: 262.36,25.68 262.36,26.47 LED64.4 | LED65.6 262.36,20.56 262.36,25.68 | LED63.3 257.38,34.91 259.98,30.82 259.98,27.74 262.04,25.68 262.36,25.68
N$54
  Top 0.61: 262.31,11.69 262.31,12.48 LED65.4 | 262.31,11.69 262.36,11.72 LED66.6 | LED64.3 259.93,23.49 259.98,18.5 262.2,16.69 262.31,11.69
N$56
  Top 0.61: 284.51,43.11 284.51,43.9 LED68.4 | 284.51,43.11 284.46,38.29 LED69.6 | 284.51,43.11 284.35,43.11 283.47,43.98 283.44,43.98 282,45.42 281.95,50.44 LED67.3
N$57
  Top 0.61: LED68.3 279.58,43.9 282.07,38.31 282.07,36.23 283.19,35.12 284.3,35.12 LED69.4 LED70.6
N$58
  Top 0.61: 284.46,25.68 284.46,26.47 LED70.4 | LED71.6 284.46,20.41 284.46,25.68 | LED69.3 279.53,34.96 282.07,33.42 282.07,27.74 284.14,25.68 284.46,25.68
N$59
  Top 0.61: 284.46,16.29 284.46,17.08 LED71.4 | 284.46,16.29 284.41,11.42 LED72.6 | LED70.3 282.07,22.44 282.07,18.35 284.14,16.29 284.46,16.29
N$61
  Top 0.61: 305.11,43.31 305.11,44.1 LED74.4 | 305.11,43.31 305.11,38.34 LED75.6 | 305.11,43.31 304.95,43.31 304.07,44.18 304.04,44.18 302.6,45.62 302.5,48.09 LED73.3
N$62
  Top 0.61: LED74.3 300.19,44.1 302.73,38.36 302.73,36.28 303.84,35.17 304.95,35.17 LED75.4 LED76.6
N$63
  Top 0.61: 305.21,25.58 305.21,26.37 LED76.4 | LED77.6 305.21,20.21 305.21,25.58 | LED75.3 300.19,35.01 302.73,33.47 302.82,27.64 304.89,25.58 305.21,25.58
N$64
  Top 0.61: 305.21,16.09 305.21,16.88 LED77.4 | 305.21,16.09 305.11,11.22 LED78.6 | LED76.3 302.93,21.49 302.82,18.15 304.89,16.09 305.21,16.09
N$66
  Top 0.61: 324.91,43.41 324.91,44.2 LED80.4 | 324.91,43.41 324.91,38.39 LED81.6 | 324.91,43.41 324.75,43.41 323.87,44.28 323.84,44.28 322.4,45.72 322.4,49.69 LED79.3
N$67
  Top 0.61: LED80.3 319.99,44.2 322.52,38.41 322.52,36.33 323.64,35.22 324.75,35.22 LED81.4 LED82.6
N$68
  Top 0.61: 324.81,20.58 324.81,26.37 LED82.4 | LED83.6 324.91,20.06 324.81,20.58 | LED81.3 319.99,35.06 322.43,30.27 322.43,27.64 324.74,26.03 324.81,20.58
N$69
  Top 0.61: 324.91,15.94 324.91,16.73 LED83.4 | 324.91,15.94 324.91,10.92 LED84.6 | LED82.3 322.52,21.09 322.52,18 324.59,15.94 324.91,15.94
RESISTOR
  Top 0.61: R1.2 375.08,34 377.05,32.04 | 377.05,32.04 R2.P$2 | 377.05,32.04 377.08,32 JP2.1 X1.2
T1
  Top 0.61: LED14.6 31.51,45.33 31.41,49.69 LED13.4 31.16,49.93 30.22,49.93 29.68,50.46 29.68,52.32 28,54 27.93,54 27.58,54.35 24.36,54.35 23,53 23,47.14 21.4,45.54 21.4,45 21,44.6 21,43 23,41 23,12 21,10.35 7.24,10.35 LED12.3
T1B
  Top 0.61: LED11.3 8.12,16 8.12,12.91 9.34,11.69 LED12.4 10.49,11.65 12.86,11.65 14.66,13.45 14.66,20.65 15.01,21 21,21 21.52,22 21.52,40 18,43 14.7,45.66 14.61,49 17,51 21.77,50.99 21.55,53.49 23.59,55.3 28.99,55.3 LED13.6
T2
  Top 0.61: LED18.3 29.32,10.06 54.63,10.06 56.55,11.6 56.51,52.6 59.05,54.79 63.24,54.79 64.12,53.9 64.12,51.52 65.32,50.33 66.26,50.33 LED19.4 66.51,50.09 66.51,45.53 LED20.6
T2B
  Top 0.61: LED17.3 29.02,15.8 29.02,12.71 30.24,11.49 LED18.4 32,11.49 53.95,11.49 55.26,12.14 55.26,18.9 55.29,18.93 55.29,52.15 55.25,52.19 55.29,52.65 55.29,53.1 55.32,53.14 55.33,53.19 55.68,53.49 56,53.82 56.05,53.82 58.01,55.5 58.01,55.55 58.66,55.8 64.2,55.8 66.45,53.56 LED19.6
T3
  Top 0.61: LED24.3 63.02,9.33 85.58,9.33 89.6,13 89.6,52.65 92.14,55.19 96.34,55.19 97.22,54.3 97.22,51.92 98.42,50.73 99.36,50.73 LED25.4 99.61,50.49 99.61,45.83 LED26.6
T3B
  Top 0.61: LED23.3 64.12,15.3 64.12,12.21 65.34,10.99 LED24.4 67.2,10.8 85,10.8 88.39,13.62 88.39,53.15 91.12,55.89 | 91.12,55.89 91.36,56.13 | LED25.6 97.15,56.23 91.91,56.2 91.14,56.09 91.12,55.89
T4
  Top 0.61: LED30.3 95.66,8.8 96.04,8.87 116.51,8.87 120.71,12.68 120.66,52.51 120.7,52.55 123.21,55.48 127.4,55.48 128.32,54.7 128.32,52.32 129.52,51.13 130.46,51.13 LED31.4 130.71,50.89 130.81,46.03 LED32.6
T4B
  Top 0.61: LED29.3 97.22,14.9 97.22,11.81 98.44,10.59 LED30.4 100.14,10.56 116,10.56 119.45,13.44 119.45,53.01 119.32,53.05 121.86,56.09 122.28,56.35 122.56,56.39 122.84,56.44 128.85,56.44 130.65,55.16 LED31.6
T5
  Top 0.61: LED36.3 127.44,8.65 | 127.44,8.65 127.48,8.75 | LED38.6 160.21,46.23 160.31,51.29 LED37.4 160.06,51.53 159.12,51.53 157.92,52.72 157.92,55.1 157.04,55.85 152.84,55.85 150.31,53.45 150.31,9.84 148.1,8.54 127.45,8.61 127.44,8.65
T5B
  Top 0.61: LED35.3 128.42,14.4 128.42,11.31 129.64,10.09 LED36.4 132.36,10.04 146.75,10.07 148.87,10.89 148.8,53.95 149.51,54.67 149.5,54.67 152,56.91 153.48,56.91 154,56.93 157.81,56.88 LED37.6
T6
  Top 0.61: LED42.3 156.52,8.17 175.83,8.17 178,10 178,53.75 180.54,56.18 184.74,56.18 185.62,55.4 185.62,53.02 186.82,51.83 187.76,51.83 LED43.4 188.01,51.59 188.01,46.48 LED44.6
T6B
  Top 0.61: LED41.3 157.82,14.1 157.82,11.01 159.04,9.79 LED42.4 161.07,9.78 175.18,9.78 176.79,10.82 176.64,54.29 179.82,57.27 185.29,57.31 187.23,55.72 187.15,55.64 LED43.6
T7
  Top 0.61: LED48.3 184.66,7.7 184.62,7.7 202.09,7.7 204,9 204,10 203.91,10.1 203.91,53.8 206.71,56.57 210.9,56.57 211.82,55.75 211.82,53.37 213.02,52.18 213.96,52.18 LED49.4 214.21,51.94 214.21,46.68 LED50.6
T7B
  Top 0.61: LED47.3 185.62,13.7 185.62,10.61 186.84,9.39 LED48.4 189.85,9.35 201.74,9.35 202.69,9.9 202.47,54.3 205.69,57.52 211.71,57.5 213.31,55.99 213.35,55.99 LED49.6
T8
  Top 0.61: LED54.3 210.75,7.48 210.8,7.43 227,7.43 229,9 229,55.45 230.54,56.92 235.74,56.92 236.62,56.1 236.62,53.72 237.82,52.53 238.76,52.53 LED55.4 239.01,52.29 239.01,46.88 LED56.6
T8B
  Top 0.61: LED53.3 211.92,16.75 211.88,10.26 213.09,9.04 LED54.4 215.32,8.91 226,8.83 227.79,10 227.63,55.95 229.63,57.92 236.57,57.92 238.11,56.34 238.15,56.34 LED55.6
T9
  Top 0.61: LED62.6 262.31,47.03 262.31,52.69 LED61.4 262.06,52.93 261.12,52.93 260,54.04 260,55 259.01,55.99 259.01,56.82 258.48,57.28 256.22,57.28 254.42,55.56 254.42,49.81 251,46.4 251,45 253.75,42.25 253.75,7.7 253.06,7 235,7 235,7.01 LED60.3
T9B
  Top 0.61: LED59.3 235.72,14.1 236.57,9.91 237.79,8.69 LED60.4 245.7,8.69 248,11 246,13 246,17 248,19 252,19 252,42 246,48 246,52 248,54 252,54 252,55 254.79,58.3 255.81,58.3 256.05,58.29 259.64,58.31 LED61.6
T10
  Top 0.61: LED66.3 258.76,7.14 259.07,6.87 272.13,6.87 274.31,8.3 274.31,50.95 277.19,56.89 277.45,57.43 281.19,57.43 282.07,56.65 282.07,54.27 283.27,53.08 284.21,53.08 LED67.4 284.46,52.84 284.51,47.23 LED68.6
T10B
  Top 0.61: LED65.3 259.98,12.75 259.98,9.66 261.19,8.44 LED66.4 262.65,8.39 270.92,8.39 272.99,9.98 272.99,51.16 273.09,51.45 273.17,51.54 275.71,56.75 275.99,57.58 276.29,57.96 276.4,58.12 276.59,58.32 276.78,58.54 276.83,58.57 | 276.83,58.57 276.8,58.5 | LED67.6 281.79,58.55 276.83,58.57
T11
  Top 0.61: LED74.6 305.11,47.43 305.26,53.09 LED73.4 305.01,53.33 304.07,53.33 303.53,53.86 303.53,55.47 301.96,57.04 301.96,57.22 301.43,57.69 296.76,57.69 295,56 295,7 293.05,6 282.63,6 LED72.3
T11B
  Top 0.61: LED71.3 282.02,12.45 282.02,9.36 283.24,8.14 LED72.4 286.18,8.26 291.92,8.26 293.79,9.21 293.79,56.51 295.9,58.7 302.36,58.74 304.56,56.34 LED73.6
T12
  Top 0.61: LED78.3 302.09,6.48 310.73,6.45 310.55,6.55 310.74,6.61 310.72,8.24 310.71,16.18 313.94,19.48 316.61,19.5 316.61,25.98 316.62,25.99 312.79,26.22 310.22,30.78 310.49,35.89 314.22,38.28 314.39,40 316.22,42.17 316.22,42.52 316.56,42.85 312,47.4 312.18,51.97 316.19,55.95 317,56 318.28,57.28 318.28,57.42 318.82,57.88 321.08,57.88 321.61,57.42 321.61,57.39 322.56,56.45 322.56,54.4 323.61,53.34 LED79.4 LED80.6
T12B
  Top 0.61: LED77.3 302.82,15.6 302.73,9.16 303.94,7.94 LED78.4 305.23,8.13 306.18,8.13 306.3,8.25 309.45,8.25 309.58,17.38 313.2,20.82 315.38,20.78 315.38,24.86 312,25 309,30 309,37 312.36,39 313,40.68 315,42.68 310.79,46.9 310.79,52.51 317.48,59.07 321.6,59.07 324.21,56.54 LED79.6
T13B
  Top 0.61: LED83.3 322.52,11.95 322.52,8.86 323.74,7.64 LED84.4
VCC  (via drill 1 pad 2)
  Top 0.61: 4,20.24 4.47,20.72 5.43,20.72 LED11.2 | 4,20.24 3.84,20.08 3.84,13.39 5.43,13.39 LED12.2 | 3.84,28.41 5.43,28.41 LED10.2 | 3.84,28.41 3.84,20.4 4,20.24 | 3.84,35.9 5.43,35.9 LED9.2 | 3.84,28.41 3.84,35.9 | 3.84,43.49 5.43,43.49 LED8.2 | 3.84,35.9 3.84,43.49 | 3.84,44.65 3.84,43.49 | 3.84,44.65 3.84,50.98 5.43,50.98 LED7.2 | 25,20.14 25.47,20.62 26.43,20.62 LED17.2 | 25,20.14 24.84,19.98 24.74,13.19 26.33,13.19 LED18.2 | 24.84,28.41 26.43,28.41 LED16.2 | 24.84,28.41 24.84,20.3 25,20.14 | 24.84,36 26.43,36 LED15.2 | 24.84,28.41 24.84,36 | 24.84,43.59 26.43,43.59 LED14.2 | 24.84,36 24.84,43.59 | 24.84,43.59 24.79,44.7 | 24.79,44.7 24.74,51.28 26.33,51.28 LED13.2 | 59.9,19.84 60.37,20.32 61.33,20.32 LED23.2 | 59.9,19.84 59.74,19.68 59.84,12.69 61.43,12.69 LED24.2 | 59.84,28.31 61.43,28.31 LED22.2 | 59.84,28.31 59.74,20 59.9,19.84 | 59.84,35.9 61.43,35.9 LED21.2 | 59.84,28.31 59.84,35.9 | 59.84,43.79 61.43,43.79 LED20.2 | 59.84,35.9 59.84,43.79 | 59.84,43.79 59.84,45 | 59.84,45 59.84,51.68 61.43,51.68 LED19.2 | 93,19.64 93.47,20.12 94.43,20.12 LED29.2 | 93,19.64 92.84,19.48 92.94,12.29 94.53,12.29 LED30.2 | 92.84,28.31 94.43,28.31 LED28.2 | 92.84,28.31 92.84,19.8 93,19.64 | 92.84,36.1 94.43,36.1 LED27.2 | 92.84,28.31 92.84,36.1 | 92.94,44.09 94.53,44.09 LED26.2 | 92.84,36.1 92.94,44.09 | 92.94,44.09 92.94,45.3 | 92.94,45.3 92.94,52.08 94.53,52.08 LED25.2 | 124.2,19.34 124.67,19.82 125.63,19.82 LED35.2 | 124.2,19.34 124.04,19.18 124.14,11.79 125.73,11.79 LED36.2 | 124.04,28.31 125.63,28.31 LED34.2 | 124.04,28.31 124.04,19.5 124.2,19.34 | 124.04,36.2 125.63,36.2 LED33.2 | 124.04,28.31 124.04,36.2 | 124.14,44.29 124.04,36.2
  Top 0.61: 124.14,44.29 124.12,45.9 | 124.12,45.9 124.04,52.48 125.63,52.48 LED31.2 | 153.7,19.14 154.17,19.62 155.13,19.62 LED41.2 | 153.7,19.14 153.54,18.98 153.54,11.49 155.13,11.49 LED42.2 | 153.54,28.21 155.13,28.21 LED40.2 | 153.54,28.21 153.54,19.3 153.7,19.14 | 153.54,36.3 155.13,36.3 LED39.2 | 153.54,28.21 153.54,36.3 | 153.54,44.49 155.13,44.49 LED38.2 | 153.54,36.3 153.54,44.49 | 153.54,44.49 153.54,46.3 | 153.54,46.3 153.64,52.88 155.23,52.88 LED37.2 | 181.45,18.89 181.92,19.37 182.88,19.37 LED47.2 | 181.45,18.89 181.29,18.73 181.34,11.09 182.93,11.09 LED48.2 | 181.34,28.16 182.93,28.16 LED46.2 | 181.34,28.16 181.29,19.05 181.45,18.89 | 181.34,36.3 182.93,36.3 LED45.2 | 181.34,28.16 181.34,36.3 | 181.34,44.74 182.93,44.74 LED44.2 | 181.34,36.3 181.34,44.74 | 181.34,44.74 181.34,46.55 | 181.34,46.55 181.34,53.18 182.93,53.18 LED43.2 | 207.7,18.69 208.17,19.17 209.13,19.17 LED53.2 | 207.7,18.69 207.54,18.53 207.59,10.74 209.18,10.74 LED54.2 | 207.59,28.16 209.18,28.16 LED52.2 | 207.59,28.16 207.54,18.85 207.7,18.69 | 207.59,36.35 209.18,36.35 LED51.2 | 207.59,28.16 207.59,36.35 | 207.54,44.94 209.13,44.94 LED50.2 | 207.59,36.35 207.54,44.94 | 207.54,44.94 207.54,46.25 | 207.54,46.25 207.54,53.53 209.13,53.53 LED49.2 | 232.5,18.49 232.97,18.97 233.93,18.97 LED59.2 | 232.5,18.49 232.34,18.33 232.29,10.39 233.88,10.39 LED60.2 | 232.34,28.06 233.93,28.06 LED58.2 | 232.34,28.06 232.34,18.65 232.5,18.49 | 232.34,36.4 233.93,36.4 LED57.2 | 232.34,28.06 232.34,36.4 | 232.34,45.14 233.93,45.14 LED56.2 | 232.34,36.4 232.34,45.14 | 232.34,45.14 232.34,46.4 | 232.34,46.4 232.34,53.88 233.93,53.88 LED55.2 | 255.85,18.34 256.32,18.82 257.28,18.82 LED65.2
  Top 0.61: 255.85,18.34 255.69,18.18 255.69,10.14 257.28,10.14 LED66.2 | 255.69,28.06 257.28,28.06 LED64.2 | 255.69,28.06 255.69,18.5 255.85,18.34 | 255.64,36.5 257.23,36.5 LED63.2 | 255.69,28.06 255.64,36.5 | 255.64,45.29 257.23,45.29 LED62.2 | 255.64,36.5 255.64,45.29 | 255.64,45.29 255.64,46.55 | 255.64,46.55 255.64,54.28 257.23,54.28 LED61.2 | 277.95,18.19 278.42,18.67 279.38,18.67 LED71.2 | 277.95,18.19 277.79,18.03 277.74,9.84 279.33,9.84 LED72.2 | 277.79,28.06 279.38,28.06 LED70.2 | 277.79,28.06 277.79,18.35 277.95,18.19 | 277.79,36.55 279.38,36.55 LED69.2 | 277.79,28.06 277.79,36.55 | 277.84,45.49 279.43,45.49 LED68.2 | 277.79,36.55 277.84,45.49 | 277.84,45.49 277.84,47.3 | 277.84,47.3 277.79,54.43 279.38,54.43 LED67.2 | 298.7,17.99 299.17,18.47 300.13,18.47 LED77.2 | 298.7,17.99 298.54,17.83 298.44,9.64 300.03,9.64 LED78.2 | 298.54,27.96 300.13,27.96 LED76.2 | 298.54,27.96 298.54,18.15 298.7,17.99 | 298.44,36.6 300.03,36.6 LED75.2 | 298.54,27.96 298.44,36.6 | 298.44,45.69 300.03,45.69 LED74.2 | 298.44,36.6 298.44,45.69 | 298.44,45.69 298.49,47 | 298.49,47 298.59,54.68 300.18,54.68 LED73.2 | 318.78,18.22 318.87,18.32 319.83,18.32 LED83.2 | 318.78,18.22 318.4,17.84 | 318.4,17.84 318.24,17.68 | LED84.2 319.83,9.34 312.67,9.34 312,10 312,15.61 314.03,17.63 318.19,17.63 318.78,18.22 | 318.14,27.96 319.73,27.96 LED82.2 | 318.14,27.96 318.24,18 318.4,17.84 | 318.24,36.65 319.83,36.65 LED81.2 | 318.24,46.24 319.83,45.79 LED80.2 | 318.24,36.65 318.24,46.24 | LED79.2 319.83,54.88 318.24,54.88 318.28,54.83 318.08,52.96 319.07,51.17 319.02,49.13 318.33,48.14 318.28,46.28 318.24,46.24 | v2.46,44.7 3.84,44.65
  Top 0.61: 24.79,44.7 v23.32,44.75 | 59.84,45 v58.3,45.02 | 92.94,45.3 v91.46,45.29 | 153.54,46.3 v152.25,45.66 | 181.34,46.55 v179.96,45.86 | 207.54,46.25 v206.16,46.17 | 232.34,46.4 232.06,46.32 v231,46.32 | 255.64,46.55 255.65,46.57 v254.31,46.47 | 277.84,47.3 277.8,46.71 v276.4,46.66 | 298.49,47 298.39,46.9 v297.11,46.8 | 318.24,46.24 316.9,45.62 v316.81,45.59 | v367,47 373.5,47 JP1.1 399.96,34.54 X1.3 | LED32.2 125.78,44.29 124.14,44.29 | 124.12,45.9 123.76,45.55 v122.71,45.5 | 318.14,27.96 318.1,28 314,28 313.29,28.72 312,31 312,35 313.65,36.65 318.24,36.65
  Bottom 0.61: v2.46,44.7 1.9,44.6 v23.32,44.75 v58.3,45.02 v91.46,45.29 v122.71,45.5 125,45.65 125.01,45.65 v152.25,45.66 v179.96,45.86 v206.16,46.17 v231,46.32 v254.31,46.47 v276.4,46.66 v297.11,46.8 v316.81,45.59 335.9,47.54 338.9,47.55 340.04,47.47 340.51,47 v367,47
  pour Bottom: 468,33 0.01,33 0.01,55.83 468,62.53

### Text on the board
Top: VioLED v2.5 Recife, 21/02/2018
Measures: 15o traste | 18o traste | 19o traste | 14o traste